# Altium schematic sheet Motor Control.SchDoc
size A
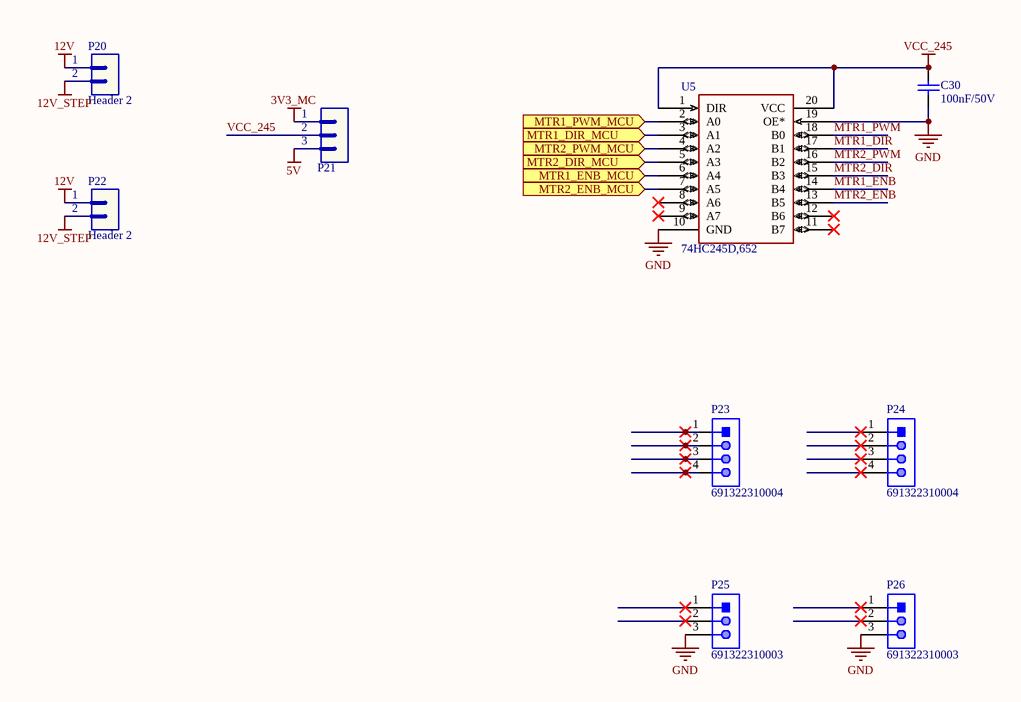
[diagram p0: Motor Control.SchDoc]

## Parts
C30  value 100nF/50V  [CAP-SM-0805]  (hidden comment: Cap-100nF-50V-0805)
P20  Header 2  [JP2]
P21  Header 3  [JP3]  (value not drawn)
P22  Header 2  [JP2]
P23  691322310004  [691322310004]
P24  691322310004  [691322310004]
P25  691322310003  [691322310003]
P26  691322310003  [691322310003]
U5  74HC245D,652  [SOT163-1_NEX]

## Ports
MTR1_DIR_MCU (in), MTR1_ENB_MCU (in), MTR1_PWM_MCU (in), MTR2_DIR_MCU (in), MTR2_ENB_MCU (in), MTR2_PWM_MCU (in)

## Nets
3V3_MC: P21.1
5V: P21.3
12V: P20.1 P22.1
12V_STEP: P20.2 P22.2
GND: C30.1 P25.3 P26.3 U5.10(GND) U5.19(OE*)
VCC_245: C30.2 P21.2 U5.1(DIR) U5.20(VCC)
MTR1_DIR: U5.17(B1)
MTR1_DIR_MCU: U5.3(A1) ; port MTR1_DIR_MCU
MTR1_ENB: U5.14(B4)
MTR1_ENB_MCU: U5.6(A4) ; port MTR1_ENB_MCU
MTR1_PWM: U5.18(B0)
MTR1_PWM_MCU: U5.2(A0) ; port MTR1_PWM_MCU
MTR2_DIR: U5.15(B3)
MTR2_DIR_MCU: U5.5(A3) ; port MTR2_DIR_MCU
MTR2_ENB: U5.13(B5)
MTR2_ENB_MCU: U5.7(A5) ; port MTR2_ENB_MCU
MTR2_PWM: U5.16(B2)
MTR2_PWM_MCU: U5.4(A2) ; port MTR2_PWM_MCU

Not connected (* = marked no-connect by the designer): P23 1* 2* 3* 4*; P24 1* 2* 3* 4*; P25 1* 2*; P26 1* 2*; U5 8(A6)* 9(A7)* 11(B7)* 12(B6)*

## Library data of the parts
C30 = Cap-100nF-50V-0805: CAP CER 0.1UF 50V Y5V 0805; Manufacturer: Samsung Electro-Mechanics; Manufacturer Part Number: CL21F104ZBCNNNC; Local Supplier: thegioiic; Local Supplier Link: https://thegioiic.com/products/tu-100nf-0-1uf-50v-0805; Supplier 1: Digikey; Supplier 1 Part Number: 1276-1007-1-ND; Supplier 1 Link: https://www.digikey.com/product-detail/en/samsung-electro-mechanics/CL21F104ZBCNNNC/1276-1007-1-ND/3889093
P20 P22 = Header 2: Header, 2-Pin; LatestRevisionDate: 17-Jul-2002; LatestRevisionNote: Re-released for DXP Platform.; Publisher: Altium Limited
P21 = Header 3: Header, 3-Pin; LatestRevisionDate: 17-Jul-2002; LatestRevisionNote: Re-released for DXP Platform.; Publisher: Altium Limited
P23 P24 = 691322310004: WR-TBL Serie 322 Horizontal PCB Header, Pluggable, pitch 3.81mm, 4p; Compliance: RoHS; Modularity: No; Pin Number: 4; Rated Current [UL]: 10A; Working Voltage [UL]: 300VAC; ComponentLink1Description: Manufacturer; ComponentLink1URL: http://www.we-online.de; ComponentLink2URL: https://katalog.we-online.de/em/datasheet/691322310004.pdf; ComponentLink2Description: Datasheet; Mounting Technology: THT; Part Number: 691322310004; Packaging: Box; Operating Temperature: -40 to +105degC; PCB/Cable/Panel: PCB; Pitch: 3.81mm; Published Date: October 2019; Type: Horizontal; Publisher: Wurth Elektronik; Application: Pluggable
P25 P26 = 691322310003: WR-TBL Serie 322 Horizontal PCB Header, Pluggable, pitch 3.81mm, 3p; Compliance: RoHS; Modularity: No; Pin Number: 3; Rated Current [UL]: 10A; Working Voltage [UL]: 300VAC; ComponentLink1Description: Manufacturer; ComponentLink1URL: http://www.we-online.de; ComponentLink2URL: https://katalog.we-online.de/em/datasheet/691322310003.pdf; ComponentLink2Description: Datasheet; Mounting Technology: THT; Part Number: 691322310003; Packaging: Box; Operating Temperature: -40 to +105degC; PCB/Cable/Panel: PCB; Pitch: 3.81mm; Published Date: October 2019; Type: Horizontal; Publisher: Wurth Elektronik; Application: Pluggable